# Altium schematic sheet Pasa Banda Inferior.SchDoc
size A3
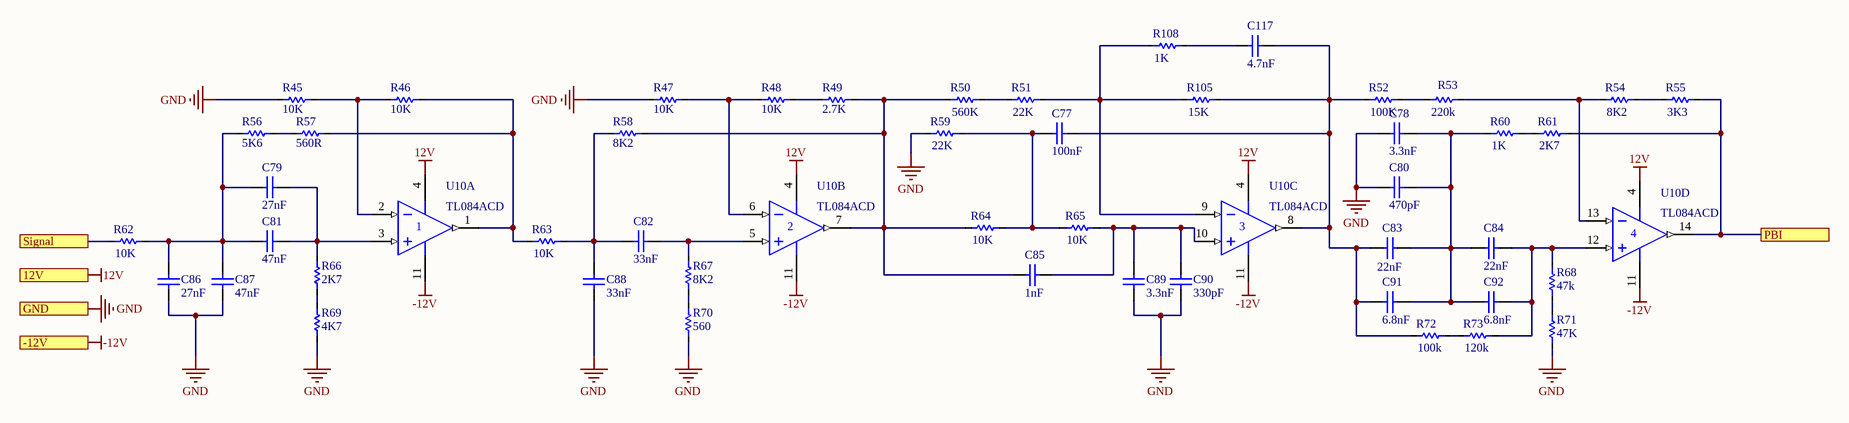
[diagram p0: Pasa Banda Inferior.SchDoc]

## Parts
C77  VALOR: 100nF  [CAP DISCO 200mil]  (hidden comment: Cap Ceramico Disco)
C78  VALOR: 3.3nF  [CAP DISCO 200mil]  (hidden comment: Cap Ceramico Disco)
C79  VALOR: 27nF  [CAP DISCO 200mil]  (hidden comment: Cap Ceramico Disco)
C80  VALOR: 470pF  [cap 10]  (hidden comment: Cap Ceramico Disco)
C81  VALOR: 47nF  [cap 10]  (hidden comment: Cap Ceramico Disco)
C82  VALOR: 33nF  [cap 10]  (hidden comment: Cap Ceramico Disco)
C83  VALOR: 22nF  [cap 10]  (hidden comment: Cap Ceramico Disco)
C84  VALOR: 22nF  [cap 10]  (hidden comment: Cap Ceramico Disco)
C85  VALOR: 1nF  [CAP DISCO 200mil]  (hidden comment: Cap Ceramico Disco)
C86  VALOR: 27nF  [CAP DISCO 200mil]  (hidden comment: Cap Ceramico Disco)
C87  VALOR: 47nF  [cap 10]  (hidden comment: Cap Ceramico Disco)
C88  VALOR: 33nF  [cap 10]  (hidden comment: Cap Ceramico Disco)
C89  VALOR: 3.3nF  [CAP DISCO 200mil]  (hidden comment: Cap Ceramico Disco)
C90  VALOR: 330pF  [CAP DISCO 150mil]  (hidden comment: Cap Ceramico Disco)
C91  VALOR: 6.8nF  [CAP DISCO 200mil]  (hidden comment: Cap Ceramico Disco)
C92  VALOR: 6.8nF  [CAP DISCO 200mil]  (hidden comment: Cap Ceramico Disco)
C117  VALOR: 4.7nF  [CAP DISCO 200mil]  (hidden comment: Cap Ceramico Disco)
R45  VALOR: 10K  [1206 resistor]  (hidden comment: Res SMD)
R46  VALOR: 10K  [1206 resistor]  (hidden comment: Res SMD)
R47  VALOR: 10K  [1206 resistor]  (hidden comment: Res SMD)
R48  VALOR: 10K  [1206 resistor]  (hidden comment: Res SMD)
R49  VALOR: 2.7K  [1206 resistor]  (hidden comment: Res SMD)
R50  VALOR: 560K  [RES AXIAL 400mil]  (hidden comment: Res SMD)
R51  VALOR: 22K  [1206 resistor]  (hidden comment: Res SMD)
R52  VALOR: 100K  [RES AXIAL 400mil]  (hidden comment: Res SMD)
R53  VALOR: 220k  [RES AXIAL 400mil]  (hidden comment: Res SMD)
R54  VALOR: 8K2  [1206 resistor]  (hidden comment: Res SMD)
R55  VALOR: 3K3  [1206 resistor]  (hidden comment: Res SMD)
R56  VALOR: 5K6  [1206 resistor]  (hidden comment: Res SMD)
R57  VALOR: 560R  [1206 resistor]  (hidden comment: Res SMD)
R58  VALOR: 8K2  [1206 resistor]  (hidden comment: Res SMD)
R59  VALOR: 22K  [1206 resistor]  (hidden comment: Res SMD)
R60  VALOR: 1K  [1206 resistor]  (hidden comment: Res SMD)
R61  VALOR: 2K7  [1206 resistor]  (hidden comment: Res SMD)
R62  VALOR: 10K  [1206 resistor]  (hidden comment: Res SMD)
R63  VALOR: 10K  [1206 resistor]  (hidden comment: Res SMD)
R64  VALOR: 10K  [1206 resistor]  (hidden comment: Res SMD)
R65  VALOR: 10K  [1206 resistor]  (hidden comment: Res SMD)
R66  VALOR: 2K7  [1206 resistor]  (hidden comment: Res SMD)
R67  VALOR: 8K2  [1206 resistor]  (hidden comment: Res SMD)
R68  VALOR: 47k  [RES AXIAL 400mil]  (hidden comment: Res SMD)
R69  VALOR: 4K7  [1206 resistor]  (hidden comment: Res SMD)
R70  VALOR: 560  [1206 resistor]  (hidden comment: Res SMD)
R71  VALOR: 47K  [RES AXIAL 400mil]  (hidden comment: Res SMD)
R72  VALOR: 100k  [RES AXIAL 400mil]  (hidden comment: Res SMD)
R73  VALOR: 120k  [RES AXIAL 400mil]  (hidden comment: Res SMD)
R105  VALOR: 15K  [1206 resistor]  (hidden comment: Res SMD)
R108  VALOR: 1K  [1206 resistor]  (hidden comment: Res SMD)
U10  TL084ACD  [751A-02_N]  (parts A,B,C,D of 4)

## Ports
12V, -12V, GND, PBI, Signal

## Nets
12V: U10.4(V+) ; port 12V
-12V: U10.11(V-) ; port -12V
GND: C78.2 C80.2 C86.1 C87.1 C88.1 C89.2 C90.2 R45.2 R47.2 R59.1 R69.1 R70.1 R71.1 ; port GND
PBI: R55.2 R61.2 U10.14(OUT) ; port PBI
Signal: R62.1 ; port Signal
NetC77_1: C77.1 C83.2 C91.2 C117.1 R52.1 R72.1 R105.2 U10.8(OUT)
NetC77_2: C77.2 R59.2 R64.2 R65.1
NetC78_1: C78.1 C80.1 C83.1 C84.2 C91.1 C92.2 R60.1
NetC79_1: C79.1 C81.1 R66.2 U10.3(IN+)
NetC79_2: C79.2 C81.2 C86.2 C87.2 R56.2 R62.2
NetC82_1: C82.1 R67.2 U10.5(IN+)
NetC82_2: C82.2 C88.2 R58.2 R63.2
NetC84_1: C84.1 C92.1 R68.2 R73.2 U10.12(IN+)
NetC85_1: C85.1 C89.1 C90.1 R65.2 U10.10(IN+)
NetC85_2: C85.2 R49.1 R50.1 R58.1 R64.1 U10.7(OUT)
NetC117_2: C117.2 R108.2
NetR45_1: R45.1 R46.2 U10.2(IN-)
NetR46_1: R46.1 R57.1 R63.1 U10.1(OUT)
NetR47_1: R47.1 R48.2 U10.6(IN-)
NetR48_1: R48.1 R49.2
NetR50_2: R50.2 R51.1
NetR51_2: R51.2 R105.1 R108.1 U10.9(IN-)
NetR52_2: R52.2 R53.1
NetR53_2: R53.2 R54.1 U10.13(IN-)
NetR54_2: R54.2 R55.1
NetR56_1: R56.1 R57.2
NetR60_2: R60.2 R61.1
NetR66_1: R66.1 R69.2
NetR67_1: R67.1 R70.2
NetR68_1: R68.1 R71.2
NetR72_2: R72.2 R73.1

## Library data of the parts
C77-C92 C117 = Cap Ceramico Disco: Capacitor Ceramico de Insercion; FABRICANTE: Generico; CODIGO STI: *; PROVEEDOR: *
U10 = TL084ACD: JFET-Input Operational Amplifier; Published: 17-Jul-2002; LatestRevisionDate: 13-Apr-2006; LatestRevisionNote: IPC-7351 Footprint Added.; DatasheetVersion: 1988; PackageVersion: 1991; PackageReference: 751A-02; Publisher: Altium Limited; PackageDescription: 14-Pin Small Outline Integrated Circuit 1.27 mm Pitch; Code_IPC: SOIC127P600-14; ComponentLink1Description: Manufacturer Link; ComponentLink1URL: http://www.onsemi.com/site/products/parametrics/0,4446,251,00.html
R45-R73 R105 R108 = Res SMD: CODIGO STI: *; PROVEEDOR: *; FABRICANTE: *; PART NUMBER: *